# EAGLE design PT-SA (EAGLE 9.6.2)
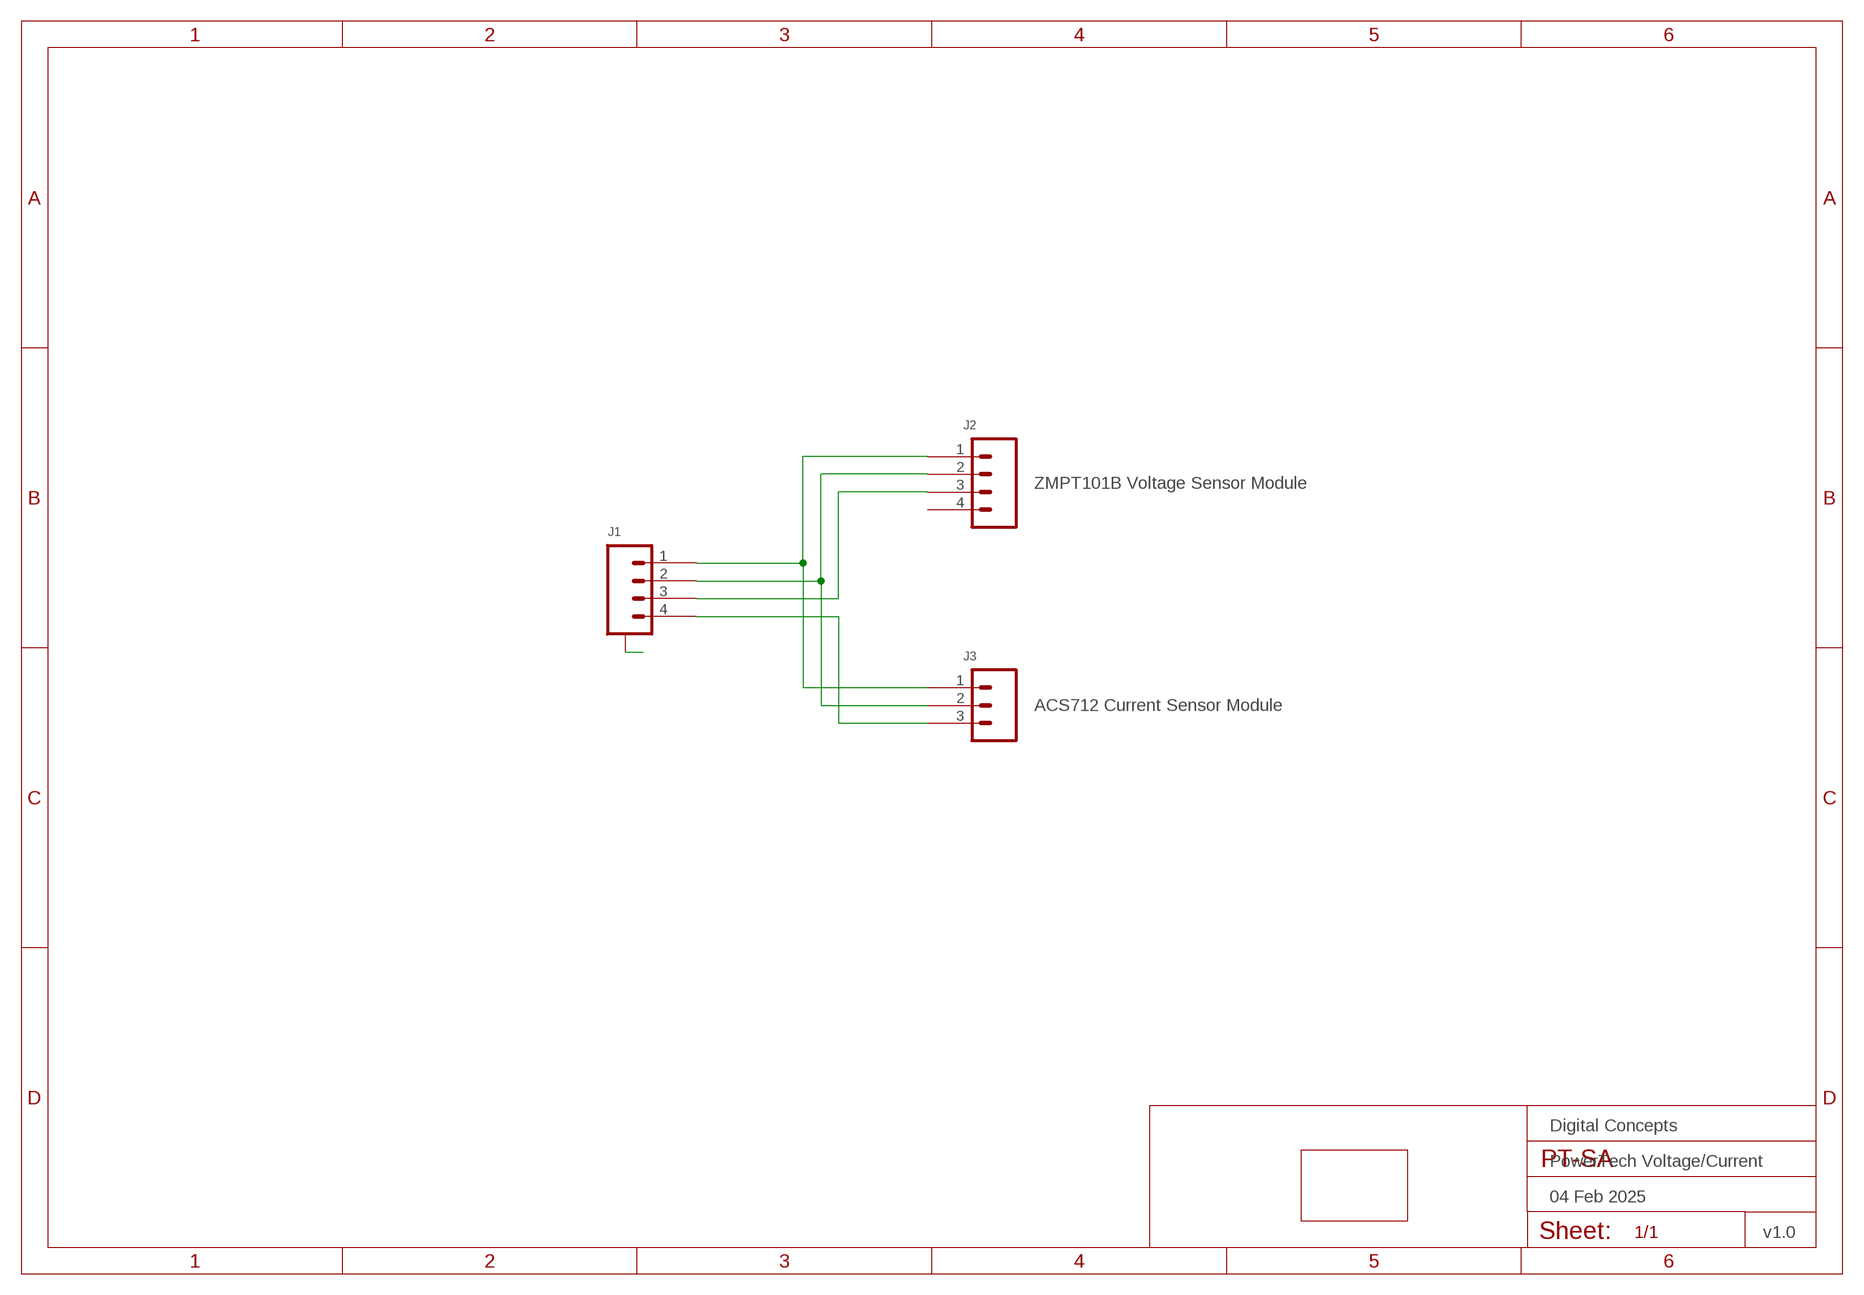
[diagram p0: schematic, sheet 1]
FRAME2 (FRAME-A4L-LOC): DATE: 04 Feb 2025; OWNER: Digital Concepts; TITLE: PowerTech Voltage/Current; VERSION: v1.0

## Parts
J1  JST-SH1.0-4-SMD-HORIZONTAL  [JST-SH1.0-4-HORIZONTAL]
J2  ZMPT101B Voltage Sensor Module  HEADER-1X4-GENERIC  [CONN_04-GENERIC]
J3  ACS712 Current Sensor Module  HEADER-1X3-GENERIC  [CONN_03-GENERIC]
PCB1  POWERTECH-SOCKET  [PCB-POWERTECH]

## Nets
A: J1.A@1(A) J1.A@4(A)
N$1: J1.1 J2.1 J3.1
N$2: J1.2 J2.2 J3.2
N$3: J1.3 J2.3
N$4: J1.4 J3.3
Unconnected: J2.4

## Library data of the parts
J1 = digitalconcepts:JST-SH1.0-4-SMD-HORIZONTAL: JST SH1.0 4P SMD horizontal connector
J2 = digitalconcepts:HEADER-1X4-GENERIC: Single Row 4-Pin Header
J3 = digitalconcepts:HEADER-1X3-GENERIC: Single Row 3-Pin Header
PCB1 = digitalconcepts:POWERTECH-SOCKET: PowerTech Socket Outlet Adaptor PCB

## Board
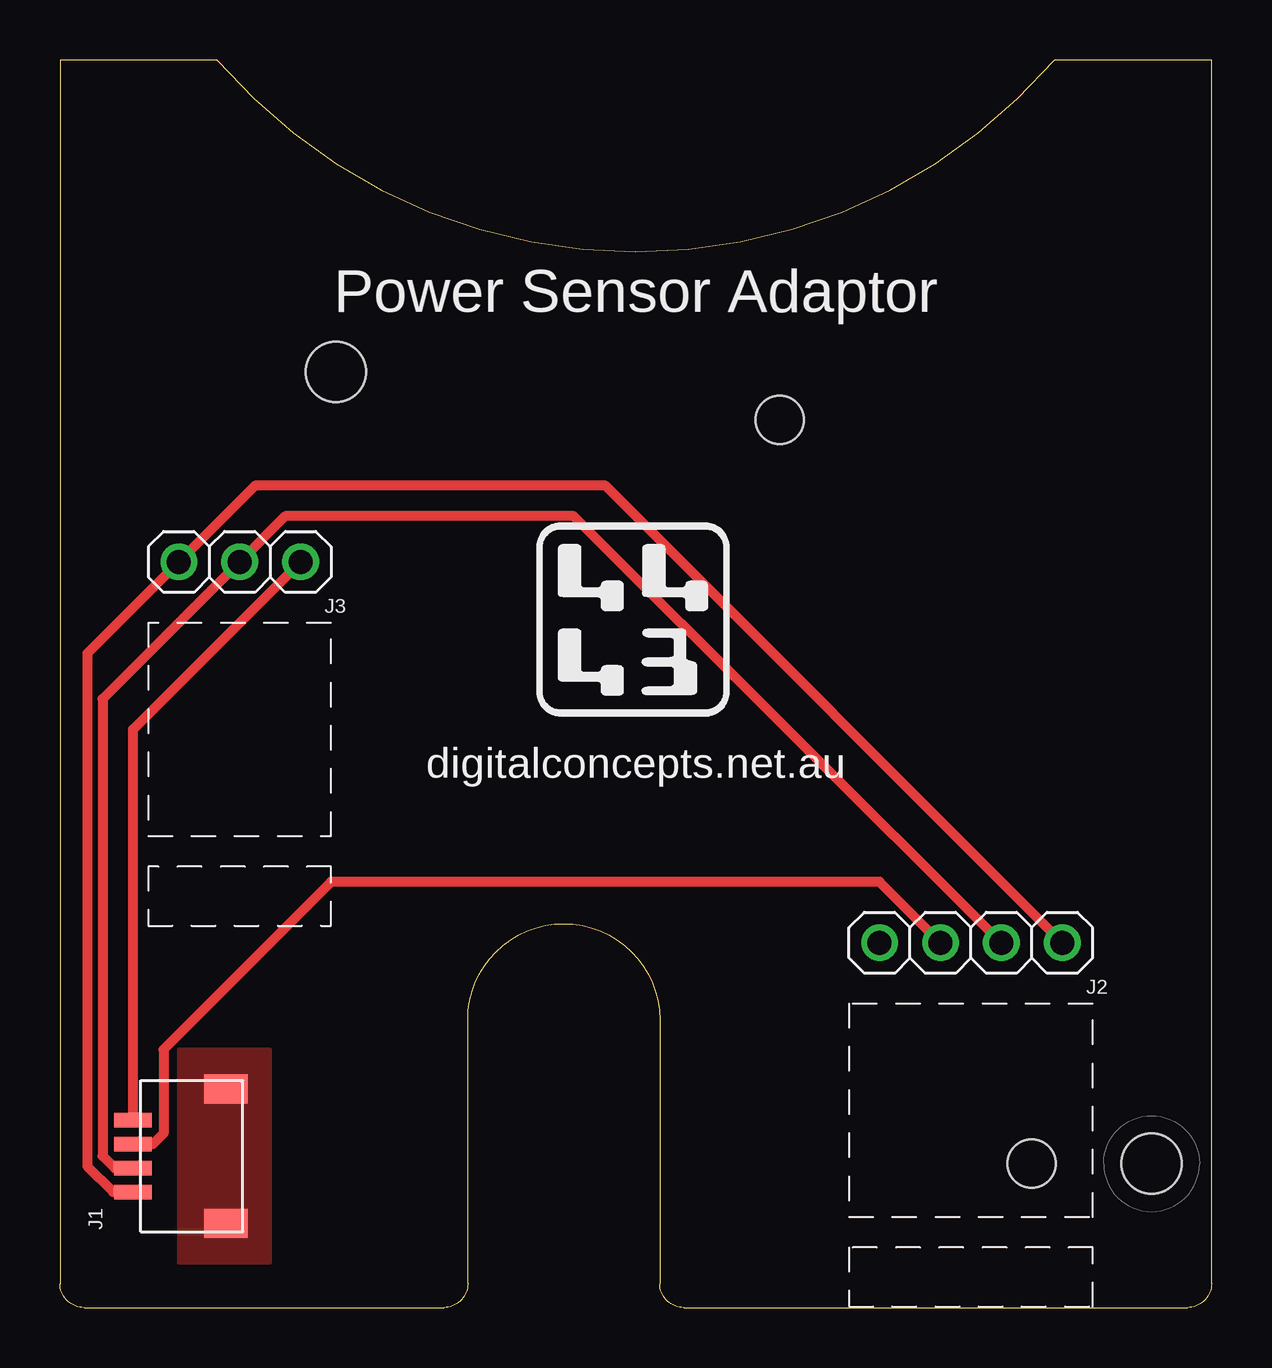
[diagram p1: board, top side]
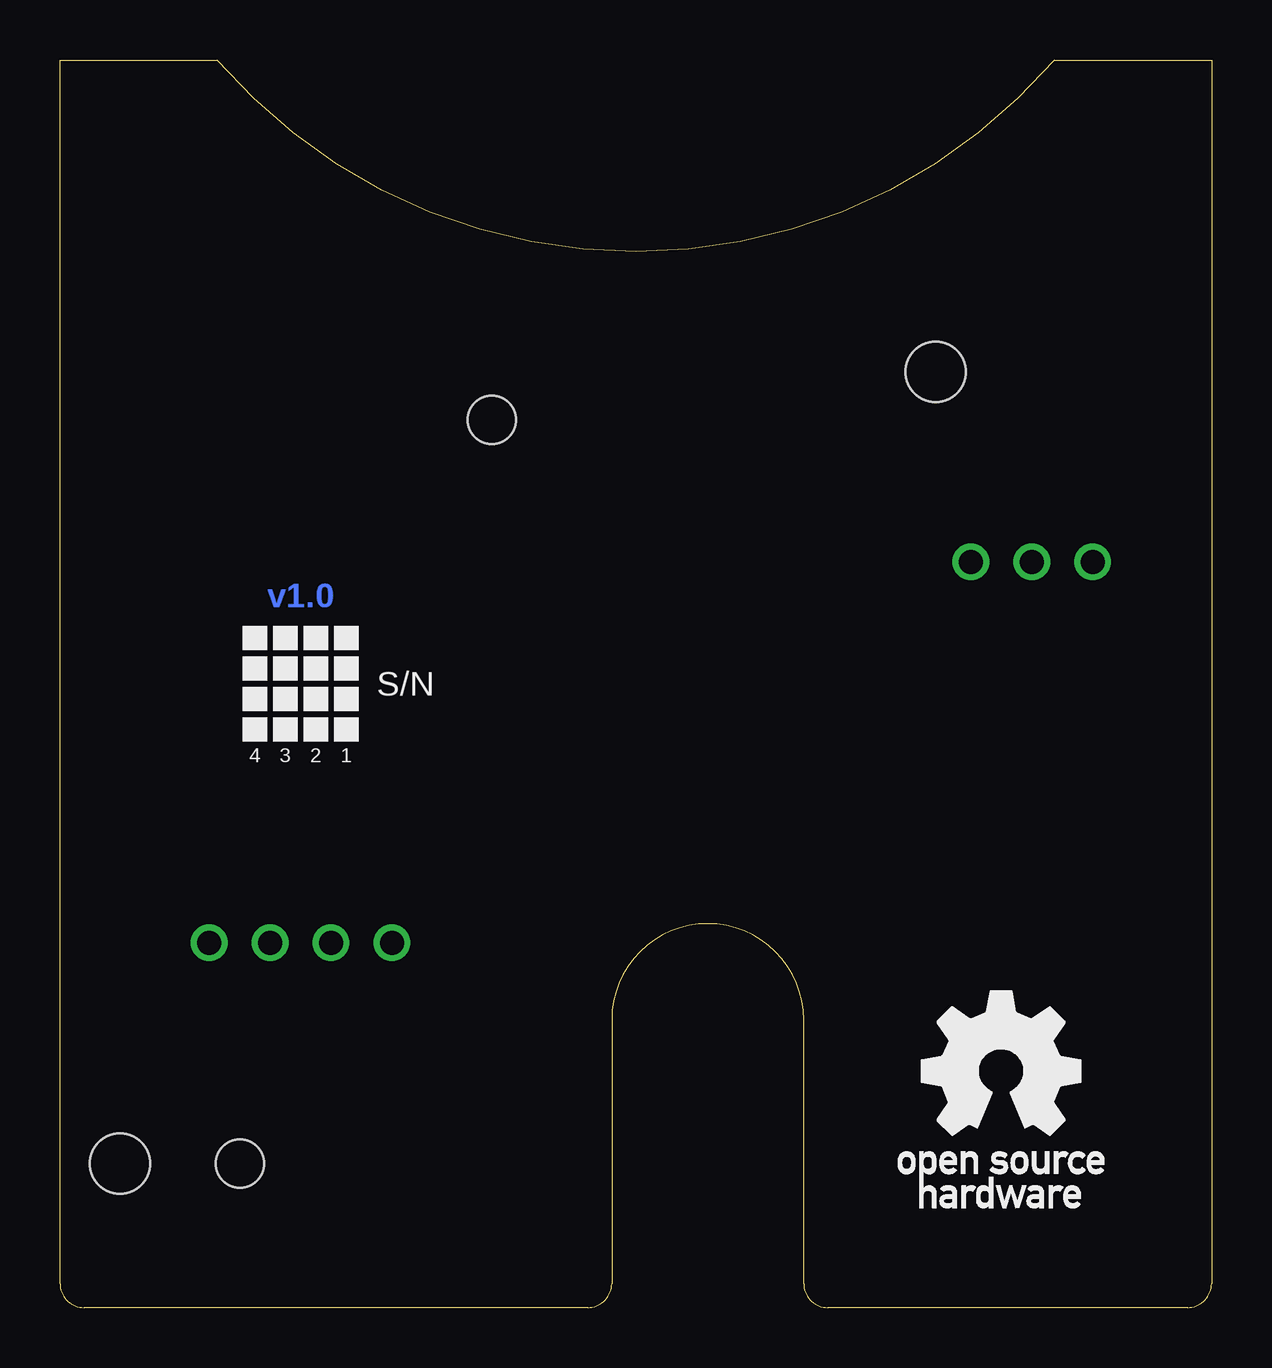
[diagram p2: board, bottom side, seen from below]

Size 48 x 52 mm. Coordinates in mm from the lower left corner, seen from the top.
Copper layers (1*16): Top 0.035mm / dielectric 1.5mm / Bottom 0.035mm
Design rules "default *": minimum track width 6mil, minimum drill 0.35mm, track to track 6mil, track to pad 6mil, pad to pad 6mil, via to via 6mil, smd to smd 6mil, copper to edge 6mil, drill to drill 6mil, minimum pad ring 10mil, minimum via ring 8mil, stop-mask expansion 4mil, vias tented up to drill 0mil, thermal gap 10mil

### Footprints (pad centres in the part's own frame; a part is rotated, then mirrored left to right if it is on the bottom)
JST-SH1.0-4-HORIZONTAL = smd 0.6 x 1.55: 1 -1.5,2.54; 2 -0.5,2.54; 3 0.5,2.54; 4 1.5,2.54 | smd 1.2 x 1.8: A@1 -2.8,-1.335; A@4 2.8,-1.335
CONN_04-GENERIC = drill 1 pad 1.524: 1 0,0; 2 2.54,0; 3 5.08,0; 4 7.62,0
CONN_03-GENERIC = drill 1 pad 1.524: 1 0,0; 2 2.54,0; 3 5.08,0
PCB-POWERTECH = hole 2.5: -20,-21.5; 13,12.5 | hole 2: -20,-16.5; 11,-6

### Placement (x,y rotation side)
J1  5.59,6.31 90 top
J2  41.78,15.2 180 top
J3  4.95,31.08 0 top
PCB1  24,26 90 top

### Tracks (layer width: path | path; a pad name or v marks a point on that pad's centre or on a via)
A
  pour Top (no thermals): 4.95,10.76 8.76,10.76 8.76,1.87 4.95,1.87
N$1
  Top 0.406: J2.1 22.73,34.25 8.13,34.25 J3.1 1.14,27.27 1.14,5.89 2.21,4.81 J1.1
N$2
  Top 0.406: J2.2 21.41,32.98 9.4,32.98 J3.2 1.78,25.36 1.78,6.31 2.28,5.81 J1.2
N$3
  Top 0.406: J2.3 34.16,17.74 11.3,17.74 4.32,10.76 4.32,7.25 3.88,6.81 J1.3
N$4
  Top 0.406: J1.4 3.05,24.09 J3.3

### Text on the board
Bottom: v1.0
tPlace: Power Sensor Adaptor | digitalconcepts.net.au
bPlace: S/N | 1 | 2 | 3 | 4